# EAGLE design board (EAGLE 7.1.0)
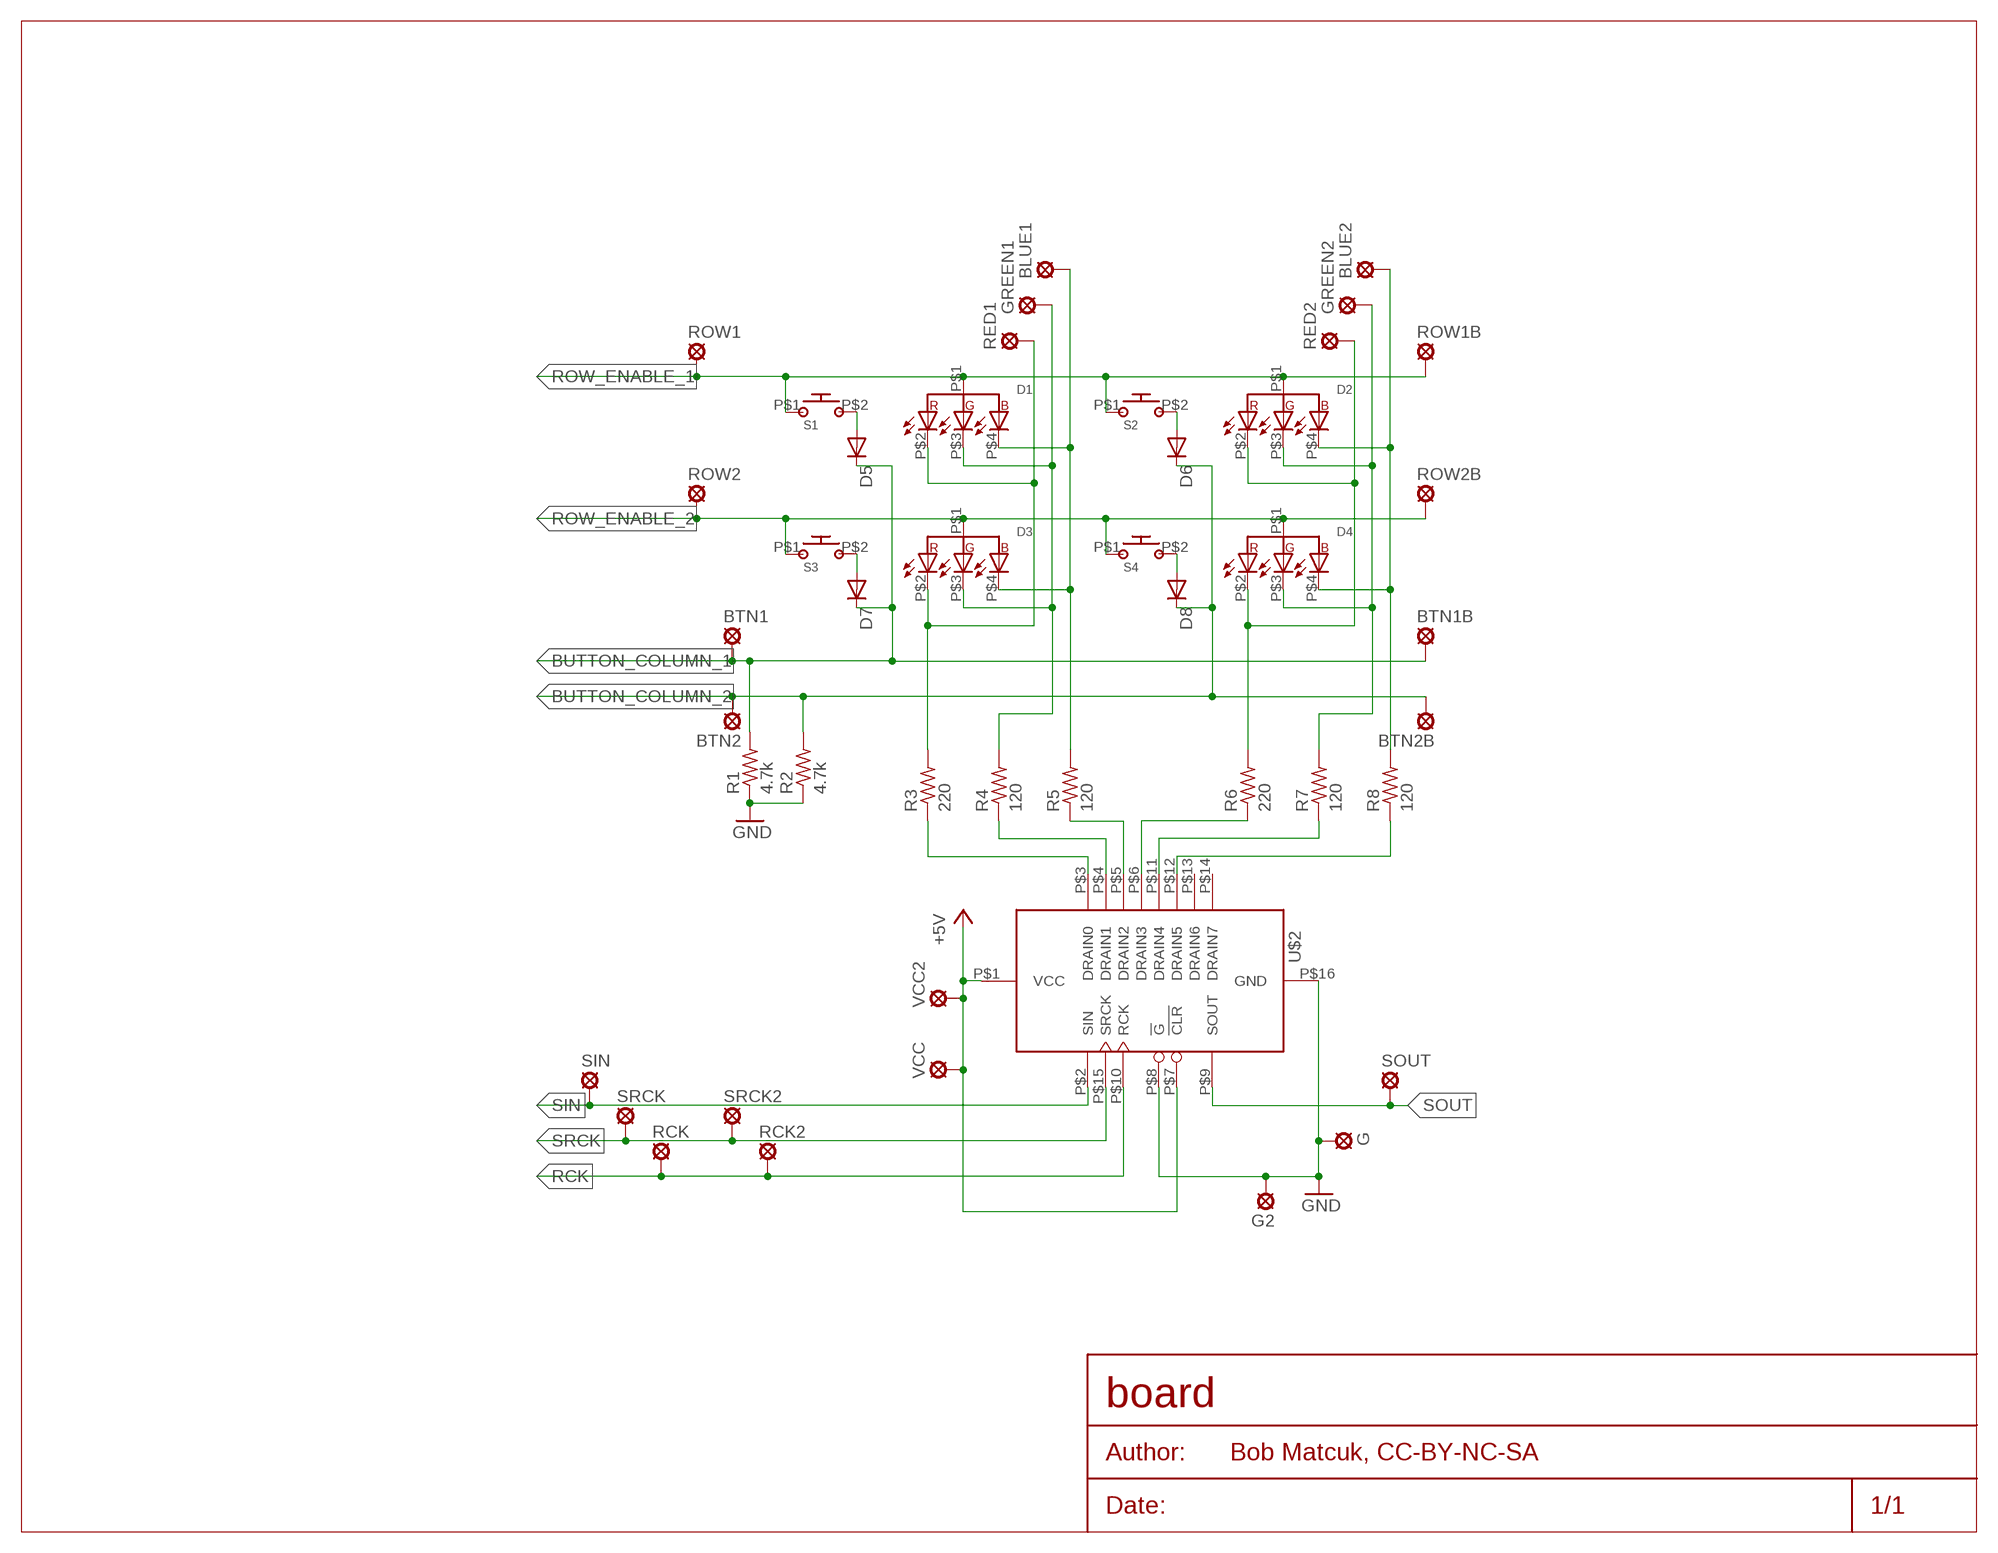
[diagram p0: schematic, sheet 1]

## Parts
BLUE1  MCS10B  [MCS10B]
BLUE2  MCS10B  [MCS10B]
BTN1  MCS10B  [MCS10B]
BTN1B  MCS10B  [MCS10B]
BTN2  MCS10B  [MCS10B]
BTN2B  MCS10B  [MCS10B]
D1  FD-5WSRGB-A  [5MM_RGB_LED]
D2  FD-5WSRGB-A  [5MM_RGB_LED]
D3  FD-5WSRGB-A  [5MM_RGB_LED]
D4  FD-5WSRGB-A  [5MM_RGB_LED]
D5  1N4148DO35-7  [DO35-7]
D6  1N4148DO35-7  [DO35-7]
D7  1N4148DO35-7  [DO35-7]
D8  1N4148DO35-7  [DO35-7]
G  MCS10B  [MCS10B]
G2  MCS10B  [MCS10B]
GREEN1  MCS10B  [MCS10B]
GREEN2  MCS10B  [MCS10B]
R1  4.7k  R-US_0207/10  [0207/10]
R2  4.7k  R-US_0207/10  [0207/10]
R3  220  R-US_0207/7  [0207/7]
R4  120  R-US_0204/5  [0204/5]
R5  120  R-US_0204/5  [0204/5]
R6  220  R-US_0207/7  [0207/7]
R7  120  R-US_0204/5  [0204/5]
R8  120  R-US_0204/5  [0204/5]
RCK  MCS10B  [MCS10B]
RCK2  MCS10B  [MCS10B]
RED1  MCS10B  [MCS10B]
RED2  MCS10B  [MCS10B]
ROW1  MCS10B  [MCS10B]
ROW1B  MCS10B  [MCS10B]
ROW2  MCS10B  [MCS10B]
ROW2B  MCS10B  [MCS10B]
S1  SANWA_OBSC_24_CW  [SANWA_24MM]
S2  SANWA_OBSC_24_CW  [SANWA_24MM]
S3  SANWA_OBSC_24_CW  [SANWA_24MM]
S4  SANWA_OBSC_24_CW  [SANWA_24MM]
SIN  MCS10B  [MCS10B]
SOUT  MCS10B  [MCS10B]
SRCK  MCS10B  [MCS10B]
SRCK2  MCS10B  [MCS10B]
U$2  STPIC6D595  [DIP16]
VCC  MCS10B  [MCS10B]
VCC2  MCS10B  [MCS10B]

## Nets
+5V: U$2.P$1(VCC) U$2.P$7(!CLR) VCC2.MP VCC.MP
BUTTON_COLUMN_1: BTN1.MP BTN1B.MP D5.C D7.C R1.2
BUTTON_COLUMN_2: BTN2.MP BTN2B.MP D6.C D8.C R2.2
GND: G2.MP G.MP R1.1 R2.1 U$2.P$8(!G) U$2.P$16(GND)
N$1: D5.A S1.P$2
N$3: D1.P$2(R) D3.P$2(R) R3.2 RED1.MP
N$4: D1.P$3(G) D3.P$3(G) GREEN1.MP R4.2
N$5: BLUE1.MP D1.P$4(B) D3.P$4(B) R5.2
N$6: R5.1 U$2.P$5(DRAIN2)
N$7: D6.A S2.P$2
N$8: R4.1 U$2.P$4(DRAIN1)
N$9: D2.P$2(R) D4.P$2(R) R6.2 RED2.MP
N$10: D2.P$3(G) D4.P$3(G) GREEN2.MP R7.2
N$11: BLUE2.MP D2.P$4(B) D4.P$4(B) R8.2
N$12: R3.1 U$2.P$3(DRAIN0)
N$13: D7.A S3.P$2
N$14: D8.A S4.P$2
N$15: R6.1 U$2.P$6(DRAIN3)
N$16: R7.1 U$2.P$11(DRAIN4)
N$17: R8.1 U$2.P$12(DRAIN5)
RCK: RCK2.MP RCK.MP U$2.P$10(RCK)
ROW_ENABLE_1: D1.P$1(ANODE) D2.P$1(ANODE) ROW1.MP ROW1B.MP S1.P$1 S2.P$1
ROW_ENABLE_2: D3.P$1(ANODE) D4.P$1(ANODE) ROW2.MP ROW2B.MP S3.P$1 S4.P$1
SIN: SIN.MP U$2.P$2(SIN)
SOUT: SOUT.MP U$2.P$9(SOUT)
SRCK: SRCK2.MP SRCK.MP U$2.P$15(SRCK)
Unconnected: U$2.P$13(DRAIN6) U$2.P$14(DRAIN7)

## Notes on the sheet
- Bob Matcuk, CC-BY-NC-SA

## Library data of the parts
BLUE1 BLUE2 BTN1 BTN1B BTN2 BTN2B G G2 GREEN1 GREEN2 RCK RCK2 RED1 RED2 ROW1 ROW1B ROW2 ROW2B SIN SOUT SRCK SRCK2 VCC VCC2 = solpad:MCS10B: SOLDER PAD MC S1, distributor Buerklin, 15F505
D1-D4 = arcaduinome:FD-5WSRGB-A: FD-5WSRGB-A Common Anode RGB LED
D5-D8 = diode:1N4148: DIODE high speed (Philips)
R1-R8 = resistor:R-US_: RESISTOR, American symbol
S1-S4 = arcaduinome:SANWA_OBSC_24_CW: Sanwa OBSC 24mm CW A 24mm arcade-style push button with clear casings and a white plunger.
U$2 = arcaduinome:STPIC6D595: STPIC6D595 The STMicroelectronics STPIC6D595 is a 74*595-style 8-bit Shift Register with output latches and open-drain DMOS transistor outputs designed for moderate load power (such as LEDs).

## Board
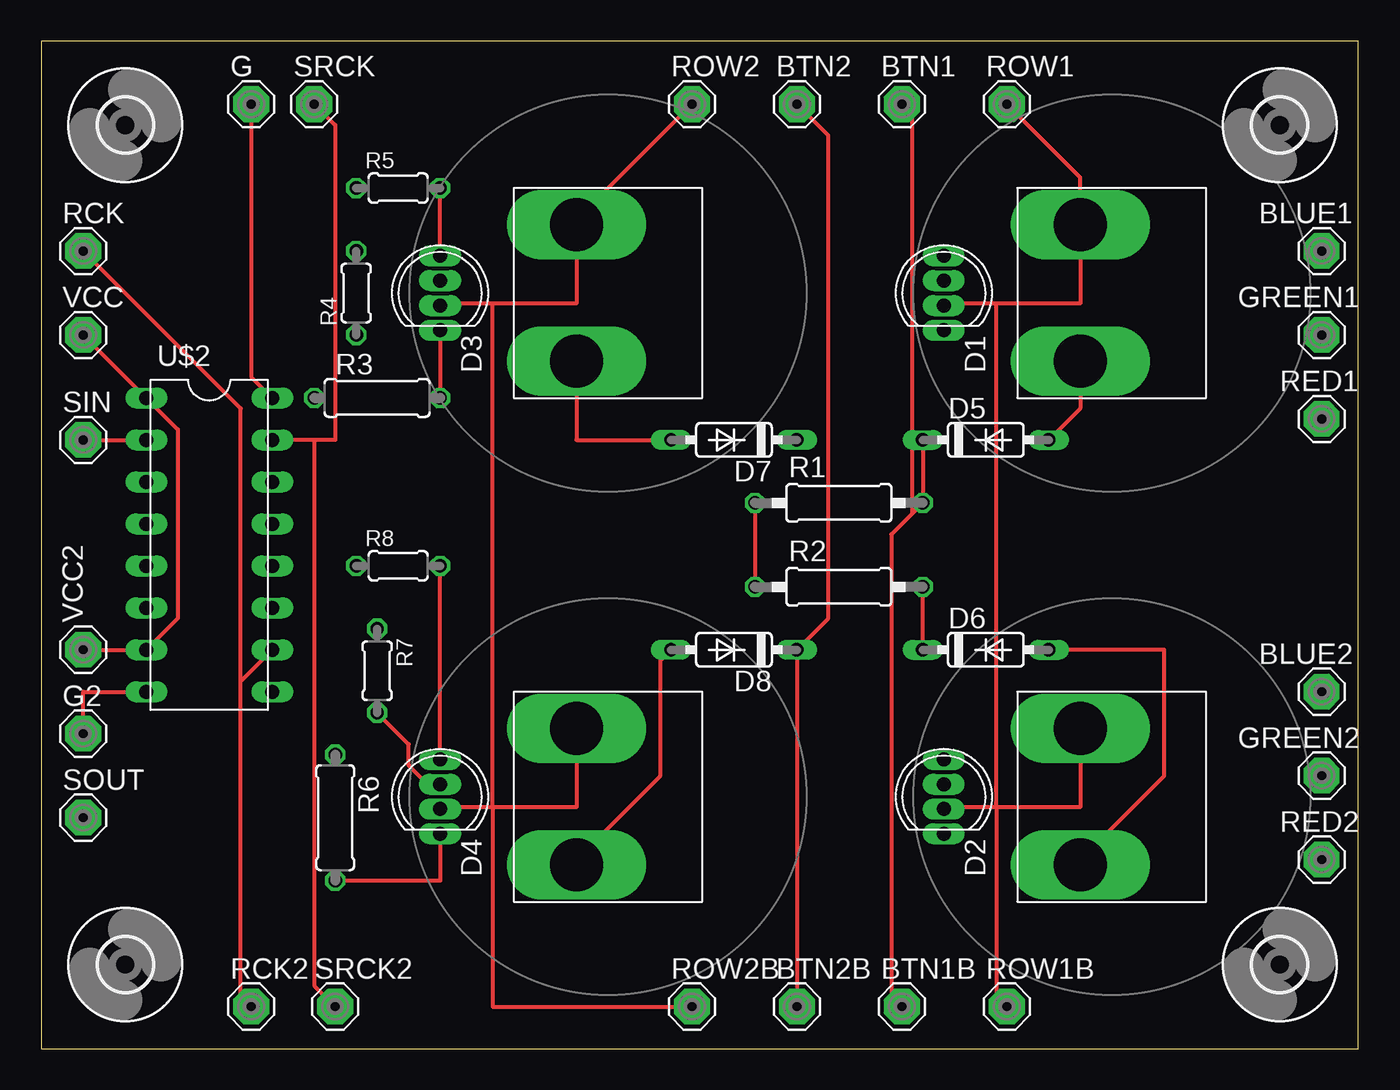
[diagram p1: board, top side]
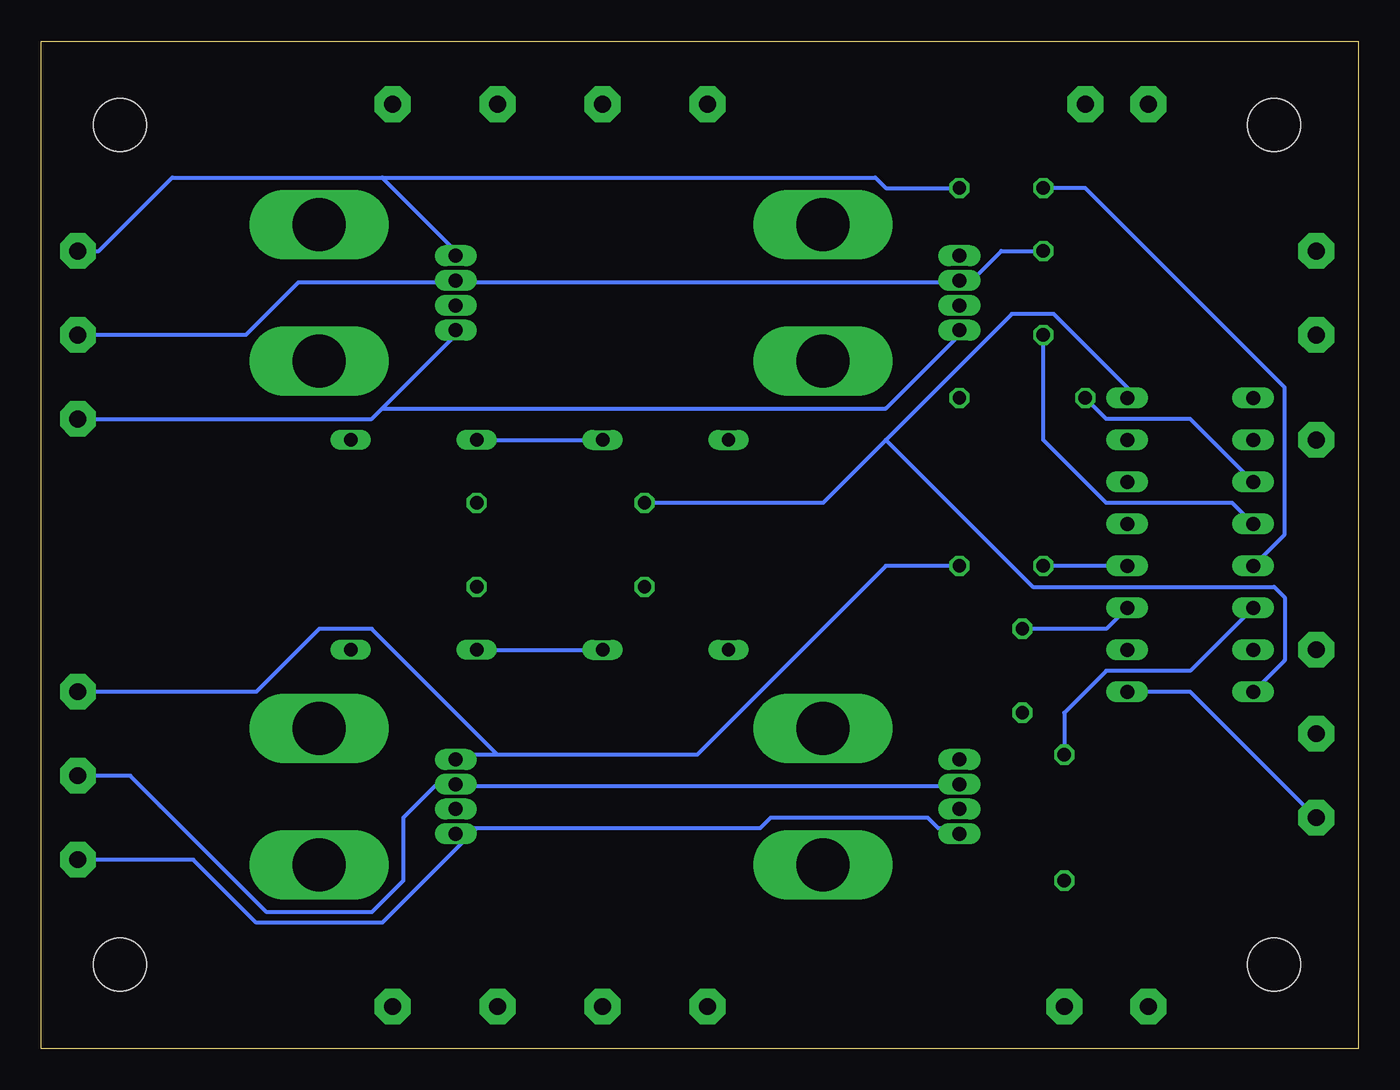
[diagram p2: board, bottom side, seen from below]

Size 79.68 x 60.95 mm. Coordinates in mm from the lower left corner, seen from the top.
Outline: 0,0 79.68,0 79.68,60.95 0,60.95 0,0
Copper layers (1*16): Top 0.0356mm / dielectric 1.5011mm / Bottom 0.0356mm
Design rules "LaenPCBOrder": minimum track width 6mil, minimum drill 13mil, track to track 6mil, track to pad 6mil, pad to pad 6mil, via to via 6mil, smd to smd 6mil, copper to edge 15mil, drill to drill 6mil, minimum pad ring 7mil, minimum via ring 7mil, stop-mask expansion 3mil, vias tented up to drill 0mil, thermal gap 10mil

### Footprints (pad centres in the part's own frame; a part is rotated, then mirrored left to right if it is on the bottom)
MCS10B = drill 1.016 pad 2.159 octagon: MP 0,0
5MM_RGB_LED = drill 0.85 pad 1.016 long: P$1 0.75,0; P$2 2.25,0; P$3 -0.75,0; P$4 -2.25,0
DO35-7 = drill 0.813 long: A 3.81,0; C -3.81,0
0207/10 = drill 0.813 octagon: 1 -5.08,0; 2 5.08,0
0207/7 = drill 0.813 octagon: 1 -3.81,0; 2 3.81,0
0204/5 = drill 0.813 octagon: 1 -2.54,0; 2 2.54,0
SANWA_24MM = drill 3.2 long: P$1 -4.128,-1.905; P$2 4.128,-1.905
DIP16 = drill 0.85 long: P$1 -8.89,-3.81; P$2 -6.35,-3.81; P$3 -3.81,-3.81; P$4 -1.27,-3.81; P$5 1.27,-3.81; P$6 3.81,-3.81; P$7 6.35,-3.81; P$8 8.89,-3.81; P$9 8.89,3.81; P$10 6.35,3.81; P$11 3.81,3.81; P$12 1.27,3.81; P$13 -1.27,3.81; P$14 -3.81,3.81; P$15 -6.35,3.81; P$16 -8.89,3.81
3,2 = hole 3.2: 0,0

### Placement (x,y rotation side)
BLUE1  77.47,48.26 0 top
BLUE2  77.47,21.59 0 top
BTN1  52.07,57.15 0 top
BTN1B  52.07,2.54 0 top
BTN2  45.72,57.15 0 top
BTN2B  45.72,2.54 0 top
D1  54.61,45.72 270 top
D2  54.61,15.24 270 top
D3  24.13,45.72 270 top
D4  24.13,15.24 270 top
D5  57.15,36.83 0 top
D6  57.15,24.13 0 top
D7  41.91,36.83 180 top
D8  41.91,24.13 180 top
G  12.7,57.15 0 top
G2  2.54,19.05 0 top
GREEN1  77.47,43.18 0 top
GREEN2  77.47,16.51 0 top
R1  48.26,33.02 0 top
R2  48.26,27.94 0 top
R3  20.32,39.37 0 top
R4  19.05,45.72 90 top
R5  21.59,52.07 0 top
R6  17.78,13.97 270 top
R7  20.32,22.86 270 top
R8  21.59,29.21 0 top
RCK  2.54,48.26 0 top
RCK2  12.7,2.54 0 top
RED1  77.47,38.1 0 top
RED2  77.47,11.43 0 top
ROW1  58.42,57.15 0 top
ROW1B  58.42,2.54 0 top
ROW2  39.37,57.15 0 top
ROW2B  39.37,2.54 0 top
S1  64.77,45.72 270 top
S2  64.77,15.24 270 top
S3  34.29,45.72 270 top
S4  34.29,15.24 270 top
SIN  2.54,36.83 0 top
SOUT  2.54,13.97 0 top
SRCK  16.51,57.15 0 top
SRCK2  17.78,2.54 0 top
U$2  10.16,30.48 270 top
U$3  [3,2]  74.93,5.08 0 top
U$4  [3,2]  74.93,55.88 0 top
U$5  [3,2]  5.08,5.08 0 top
U$6  [3,2]  5.08,55.88 0 top
VCC  2.54,43.18 0 top
VCC2  2.54,24.13 0 top

### Tracks (layer width: path | path; a pad name or v marks a point on that pad's centre or on a via)
+5V
  Top 0.254: VCC2.MP U$2.P$7 8.26,26.04 8.26,37.47 U$2.P$1 VCC.MP
BUTTON_COLUMN_1
  Top 0.254: D5.C R1.2 52.7,32.38 | BTN1B.MP 51.44,3.17 51.44,31.11 52.7,32.38 | BTN1.MP 52.7,56.52 52.7,32.38
  Bottom 0.254: D5.C D7.C
BUTTON_COLUMN_2
  Top 0.254: D6.C R2.2 | BTN2B.MP D8.C 47.62,26.04 47.62,55.24 BTN2.MP
  Bottom 0.254: D6.C D8.C
GND
  Top 0.254: U$2.P$8 2.54,21.59 G2.MP | R1.1 R2.1 | U$2.P$16 12.7,40.64 G.MP
  Bottom 0.254: R1.1 32.38,33.02 28.57,36.83 | 28.57,36.83 20.95,44.45 18.41,44.45 13.97,40.01 U$2.P$16 | U$2.P$8 4.45,23.5 4.45,27.3 5.08,27.94 19.68,27.94 28.57,36.83
N$1
  Top 0.254: D5.A 62.87,38.73 S1.P$2
N$3
  Top 0.254: D3.P$2 R3.2
  Bottom 0.254: 59.05,38.73 59.69,38.1 RED1.MP | 59.05,38.73 54.61,43.18 D1.P$2 | 59.05,38.73 28.57,38.73 24.13,43.18 D3.P$2
N$4
  Bottom 0.254: R4.2 21.59,48.26 23.5,46.35 24.13,46.35 | 24.13,46.35 54.61,46.35 | 24.13,46.35 D3.P$3 | GREEN1.MP 67.31,43.18 64.14,46.35 54.61,46.35 | 54.61,46.35 D1.P$3
N$5
  Top 0.254: D3.P$4 R5.2
  Bottom 0.254: 59.05,52.7 54.61,48.26 D1.P$4 | 59.05,52.7 71.75,52.7 76.2,48.26 BLUE1.MP | R5.2 28.57,52.07 29.21,52.7 59.05,52.7
N$6
  Bottom 0.254: R5.1 16.51,52.07 4.45,40.01 4.45,31.11 U$2.P$5
N$7
  Top 0.254: D6.A 67.94,24.13 67.94,16.51 62.87,11.43 S2.P$2
N$8
  Bottom 0.254: R4.1 19.05,36.83 15.24,33.02 7.62,33.02 U$2.P$4
N$9
  Top 0.254: R6.2 24.13,10.16 D4.P$2
  Bottom 0.254: 53.34,13.34 36.2,13.34 35.56,13.97 26.04,13.97 25.4,13.34 24.13,13.34 D4.P$2 | 53.34,13.34 54.61,13.34 D2.P$2 53.34,13.34 | RED2.MP 70.48,11.43 66.67,7.62 59.05,7.62 53.34,13.34
N$10
  Top 0.254: R7.2 22.23,18.41 22.23,17.14 23.5,15.88 24.13,15.88 D4.P$3
  Bottom 0.254: 54.61,15.88 24.13,15.88 D4.P$3 | GREEN2.MP 74.3,16.51 66.04,8.26 59.69,8.26 57.78,10.16 57.78,13.97 55.88,15.88 54.61,15.88 | 54.61,15.88 D2.P$3
N$11
  Top 0.254: D4.P$4 R8.2
  Bottom 0.254: 52.07,17.78 40.01,17.78 28.57,29.21 R8.2 | 52.07,17.78 54.61,17.78 D2.P$4 | BLUE2.MP 66.67,21.59 62.87,25.4 59.69,25.4 52.07,17.78
N$12
  Bottom 0.254: R3.1 15.24,38.1 10.16,38.1 U$2.P$3
N$13
  Top 0.254: D7.A 32.38,36.83 S3.P$2
N$14
  Top 0.254: D8.A 37.47,23.5 37.47,16.51 32.38,11.43 S4.P$2
N$15
  Bottom 0.254: R6.1 17.78,20.32 15.24,22.86 10.16,22.86 U$2.P$6
N$16
  Bottom 0.254: R7.1 15.24,25.4 U$2.P$11
N$17
  Bottom 0.254: U$2.P$12 R8.1
RCK
  Top 0.254: 12.06,22.23 U$2.P$10 | 12.06,22.23 12.06,3.17 RCK2.MP | RCK.MP 12.06,38.73 12.06,22.23
ROW_ENABLE_1
  Top 0.254: 57.78,45.09 62.87,45.09 S1.P$1 62.87,52.7 ROW1.MP | 57.78,45.09 54.61,45.09 D1.P$1 | 57.78,14.61 62.87,14.61 S2.P$1 | 57.78,14.61 54.61,14.61 D2.P$1 | ROW1B.MP 57.78,3.17 57.78,14.61 | 57.78,14.61 57.78,45.09
ROW_ENABLE_2
  Top 0.254: 27.3,45.09 32.38,45.09 S3.P$1 32.38,50.16 ROW2.MP | 27.3,45.09 24.13,45.09 D3.P$1 | 27.3,14.61 32.38,14.61 S4.P$1 | 27.3,14.61 24.13,14.61 D4.P$1 | ROW2B.MP 27.3,2.54 27.3,14.61 | 27.3,14.61 27.3,45.09
SIN
  Top 0.254: SIN.MP U$2.P$2
SOUT
  Bottom 0.254: U$2.P$9 10.16,21.59 SOUT.MP
SRCK
  Top 0.254: 16.51,36.83 17.78,36.83 17.78,55.88 SRCK.MP | 16.51,36.83 U$2.P$15 | SRCK2.MP 16.51,3.81 16.51,36.83